# Altium schematic sheet can.SchDoc
size A4; SheetNumber: 5; SheetTotal: 9
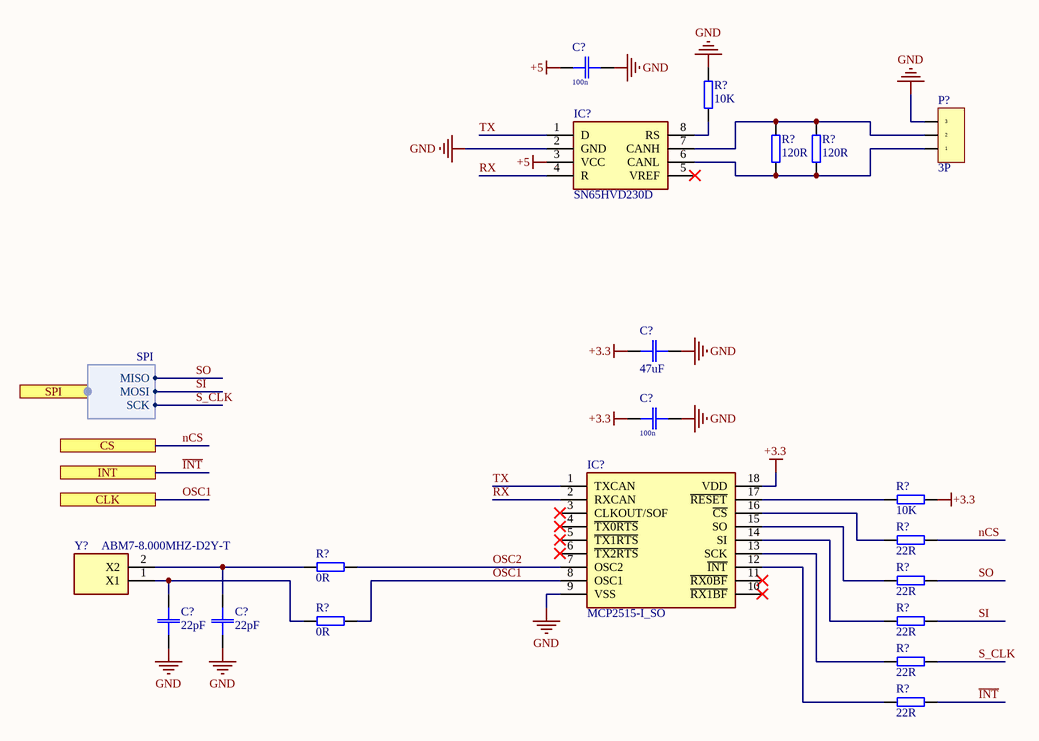
[diagram p0: can.SchDoc]

## Parts
(Parts that share a designator on the sheet are numbered #1, #2 ... from top to bottom, then left to right.)
C?#1  100n  [C0603]
C?#2  47uF  [CAP: 1210]
C?#3  100n  [C0603]
C?#4  22pF  [CAP: 0603]
C?#5  22pF  [CAP: 0603]
IC?#1  SN65HVD230D  [SOIC127P600X175-8N]
IC?#2  MCP2515-I_SO  [SOIC127P1030X265-18N]
P?  3P  [CON: 3P V 3.5mm]
R?#1  10K  [RES: 0603]
R?#2  120R  [RES: 0603]
R?#3  120R  [RES: 0603]
R?#4  10K  [RES: 0603]
R?#5  22R  [RES: 0603]
R?#6  0R  [RES: 0603]
R?#7  22R  [RES: 0603]
R?#8  0R  [RES: 0603]
R?#9  22R  [RES: 0603]
R?#10  22R  [RES: 0603]
R?#11  22R  [RES: 0603]
Y?  ABM7-8.000MHZ-D2Y-T  [ABM78000MHZD2YT]

## Ports
CLK, CS, INT, SPI (harness SPI)

## Harnesses
SPI: MISO, SCK, MOSI

## Nets
+3.3: C?#2.2 C?#3.1 IC?#2.18(VDD) R?#4.2
+5: C?#1.1 IC?#1.3(VCC)
GND: C?#1.2 C?#2.1 C?#3.2 C?#4.1 C?#5.1 IC?#1.2(GND) IC?#2.9(VSS) P?.3 R?#1.1
~{INT}: R?#11.1 ; port INT
nCS: R?#5.1 ; port CS
OSC1: IC?#2.8(OSC1) R?#8.2 ; port CLK
OSC2: IC?#2.7(OSC2) R?#6.2
RX: IC?#1.4(R) IC?#2.2(RXCAN)
S_CLK: R?#10.1 ; port SPI.SCK
SI: R?#9.1 ; port SPI.MOSI
SO: R?#7.1 ; port SPI.MISO
TX: IC?#1.1(D) IC?#2.1(TXCAN)
NetC?#4_2: C?#4.2 R?#8.1 Y?.1(X1)
NetC?#5_2: C?#5.2 R?#6.1 Y?.2(X2)
NetIC?#1_6: IC?#1.6(CANL) P?.1 R?#2.2 R?#3.2
NetIC?#1_7: IC?#1.7(CANH) P?.2 R?#2.1 R?#3.1
NetIC?#1_8: IC?#1.8(RS) R?#1.2
NetIC?#2_12: IC?#2.12(~{INT}) R?#11.2
NetIC?#2_13: IC?#2.13(SCK) R?#10.2
NetIC?#2_14: IC?#2.14(SI) R?#9.2
NetIC?#2_15: IC?#2.15(SO) R?#7.2
NetIC?#2_16: IC?#2.16(~{CS}) R?#5.2
NetIC?#2_17: IC?#2.17(~{RESET}) R?#4.1

Not connected (* = marked no-connect by the designer): IC?#1 5(VREF)*; IC?#2 3(CLKOUT/SOF)* 4(~{TX0RTS})* 5(~{TX1RTS})* 6(~{TX2RTS})* 10(~{RX1BF})* 11(~{RX0BF})*

## Library data of the parts
C?#1 C?#3 = C-0603: SMD-0603; Price: 0.014; Value: 100n
C?#2 C?#4 C?#5 = C_SMD
  C?#2: Value: 47uF
  C?#4 C?#5: Value: 22pF
IC?#1 = SN65HVD230D: Integrated Circuit; Manufacturer_Name: Texas Instruments; Datasheet Link: http://www.ti.com/lit/ds/symlink/sn65hvd230.pdf; Height: 1.75mm; Manufacturer_Part_Number: SN65HVD230D; Mouser Part Number: 595-SN65HVD230D; Mouser Price/Stock: https://www.mouser.co.uk/ProductDetail/Texas-Instruments/SN65HVD230D?qs=QViXGNcIEAskSxPh50NSwA%3D%3D; Arrow Part Number: SN65HVD230D; Arrow Price/Stock: https://www.arrow.com/en/products/sn65hvd230d/texas-instruments?region=nac
IC?#2 = MCP2515-I_SO: Integrated Circuit; Manufacturer_Name: Microchip; Manufacturer_Part_Number: MCP2515-I/SO; Datasheet Link: https://datasheet.datasheetarchive.com/originals/distributors/Datasheets-34/DSA-675138.pdf; Height: 2.65mm; Mouser Part Number: 579-MCP2515-I/SO; Mouser Price/Stock: https://www.mouser.co.uk/ProductDetail/Microchip-Technology/MCP2515-I-SO?qs=KwArPi4cUogGDbGnphOvtQ%3D%3D; Arrow Part Number: MCP2515-I/SO; Arrow Price/Stock: https://www.arrow.com/en/products/mcp2515-iso/microchip-technology?region=nac
R?#1-R?#11 = R_SMD
  R?#1 R?#4: Value: 10K
  R?#2 R?#3: Value: 120R
  R?#5 R?#7 R?#9-R?#11: Value: 22R
  R?#6 R?#8: Value: 0R
Y? = ABM7-8.000MHZ-D2Y-T: Crystal or Oscillator; Manufacturer_Name: ABRACON; Datasheet Link: http://www.abracon.com/Resonators/abm7.pdf; Height: 1.4mm; Manufacturer_Part_Number: ABM7-8.000MHZ-D2Y-T; Mouser Part Number: 815-ABM7-8-D2Y-T; Mouser Price/Stock: https://www.mouser.co.uk/ProductDetail/ABRACON/ABM7-8000MHZ-D2Y-T?qs=LoTOQoUkC8SFsmY8snleBA%3D%3D; Arrow Part Number: ABM7-8.000MHZ-D2Y-T; Arrow Price/Stock: https://www.arrow.com/en/products/abm7-8.000mhz-d2y-t/abracon?region=nac
P? = 3P: Value: 3P